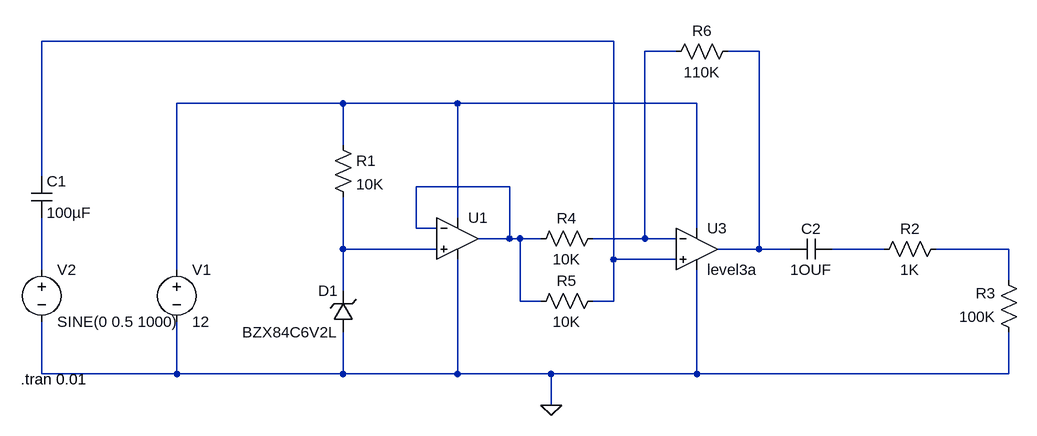
[diagram p0: schematic OUT_AMP_01.asc]
OUT_AMP_01.asc, the LTspice schematic file:
Version 4
SHEET 1 996 680
WIRE 368 -112 -512 -112
WIRE 464 -96 416 -96
WIRE 592 -96 544 -96
WIRE -48 -16 -304 -16
WIRE 128 -16 -48 -16
WIRE 496 -16 128 -16
WIRE -48 48 -48 -16
WIRE -512 96 -512 -112
WIRE 208 112 64 112
WIRE 128 160 128 -16
WIRE 64 176 64 112
WIRE 96 176 64 176
WIRE 496 176 496 -16
WIRE 208 192 208 112
WIRE 208 192 160 192
WIRE 224 192 208 192
WIRE 256 192 224 192
WIRE 416 192 416 -96
WIRE 416 192 336 192
WIRE 464 192 416 192
WIRE -48 208 -48 128
WIRE 96 208 -48 208
WIRE 592 208 592 -96
WIRE 592 208 528 208
WIRE 640 208 592 208
WIRE 784 208 704 208
WIRE 976 208 864 208
WIRE 368 224 368 -112
WIRE 464 224 368 224
WIRE -512 240 -512 160
WIRE -304 240 -304 -16
WIRE 976 256 976 208
WIRE -48 272 -48 208
WIRE 224 288 224 192
WIRE 256 288 224 288
WIRE 368 288 368 224
WIRE 368 288 336 288
WIRE -512 400 -512 320
WIRE -304 400 -304 320
WIRE -304 400 -512 400
WIRE -48 400 -48 336
WIRE -48 400 -304 400
WIRE 128 400 128 224
WIRE 128 400 -48 400
WIRE 272 400 128 400
WIRE 496 400 496 240
WIRE 496 400 272 400
WIRE 976 400 976 336
WIRE 976 400 496 400
WIRE 272 448 272 400
FLAG 272 448 0
DATAFLAG 32 208 ""
SYMBOL Opamps\\UniversalOpamp 128 192 R0
SYMATTR InstName U1
SYMBOL res -64 32 R0
SYMATTR InstName R1
SYMATTR Value 10K
SYMBOL voltage -304 224 R0
SYMATTR InstName V1
SYMATTR Value 12
SYMBOL voltage -512 224 R0
WINDOW 123 0 0 Left 0
WINDOW 39 0 0 Left 0
SYMATTR InstName V2
SYMATTR Value SINE(0 0.5 1000)
SYMBOL zener -32 336 R180
WINDOW 0 24 64 Left 2
WINDOW 3 24 0 Left 2
SYMATTR InstName D1
SYMATTR Value BZX84C6V2L
SYMBOL cap -528 96 R0
SYMATTR InstName C1
SYMATTR Value 100µF
SYMBOL cap 704 192 R90
WINDOW 0 0 32 VBottom 2
WINDOW 3 32 32 VTop 2
SYMATTR InstName C2
SYMATTR Value 1OUF
SYMBOL res 880 192 R90
WINDOW 0 0 56 VBottom 2
WINDOW 3 32 56 VTop 2
SYMATTR InstName R2
SYMATTR Value 1K
SYMBOL res 992 352 R180
WINDOW 0 36 76 Left 2
WINDOW 3 36 40 Left 2
SYMATTR InstName R3
SYMATTR Value 100K
SYMBOL res 352 176 R90
WINDOW 0 0 56 VBottom 2
WINDOW 3 32 56 VTop 2
SYMATTR InstName R4
SYMATTR Value 10K
SYMBOL res 352 272 R90
WINDOW 0 0 56 VBottom 2
WINDOW 3 32 56 VTop 2
SYMATTR InstName R5
SYMATTR Value 10K
SYMBOL res 560 -112 R90
WINDOW 0 0 56 VBottom 2
WINDOW 3 32 56 VTop 2
SYMATTR InstName R6
SYMATTR Value 110K
SYMBOL Opamps\\UniversalOpamp3 496 208 R0
SYMATTR InstName U3
TEXT -544 408 Left 2 !.tran 0.01

The netlist it stands for:
* OUT_AMP_01.asc
XU1 N006 N005 N004 0 N005 level1 Avol=1Meg GBW=10Meg Vos=0 En=0 Enk=0 In=0 Ink=0 Rin=500Meg  ; pins In+ In- V+ V- OUT
R1 N004 N006 10K
V1 N004 0 12
V2 N009 0 SINE(0 0.5 1000)
D1 0 N006 BZX84C6V2L
C1 N001 N009 100µF
C2 N007 N003 1OUF
R2 N008 N007 1K
R3 0 N008 100K
R4 N002 N005 10K
R5 N001 N005 10K
R6 N003 N002 110K
XU3 N001 N002 N004 0 N003 level3a  ; pins In+ In- V+ V- OUT
.model D D
.lib standard.dio
.tran 0.01
.lib UniversalOpAmp1.lib
.backanno
.end